# Altium schematic sheet Top_schematic.SchDoc
size A4; SheetNumber: 1; SheetTotal: 18
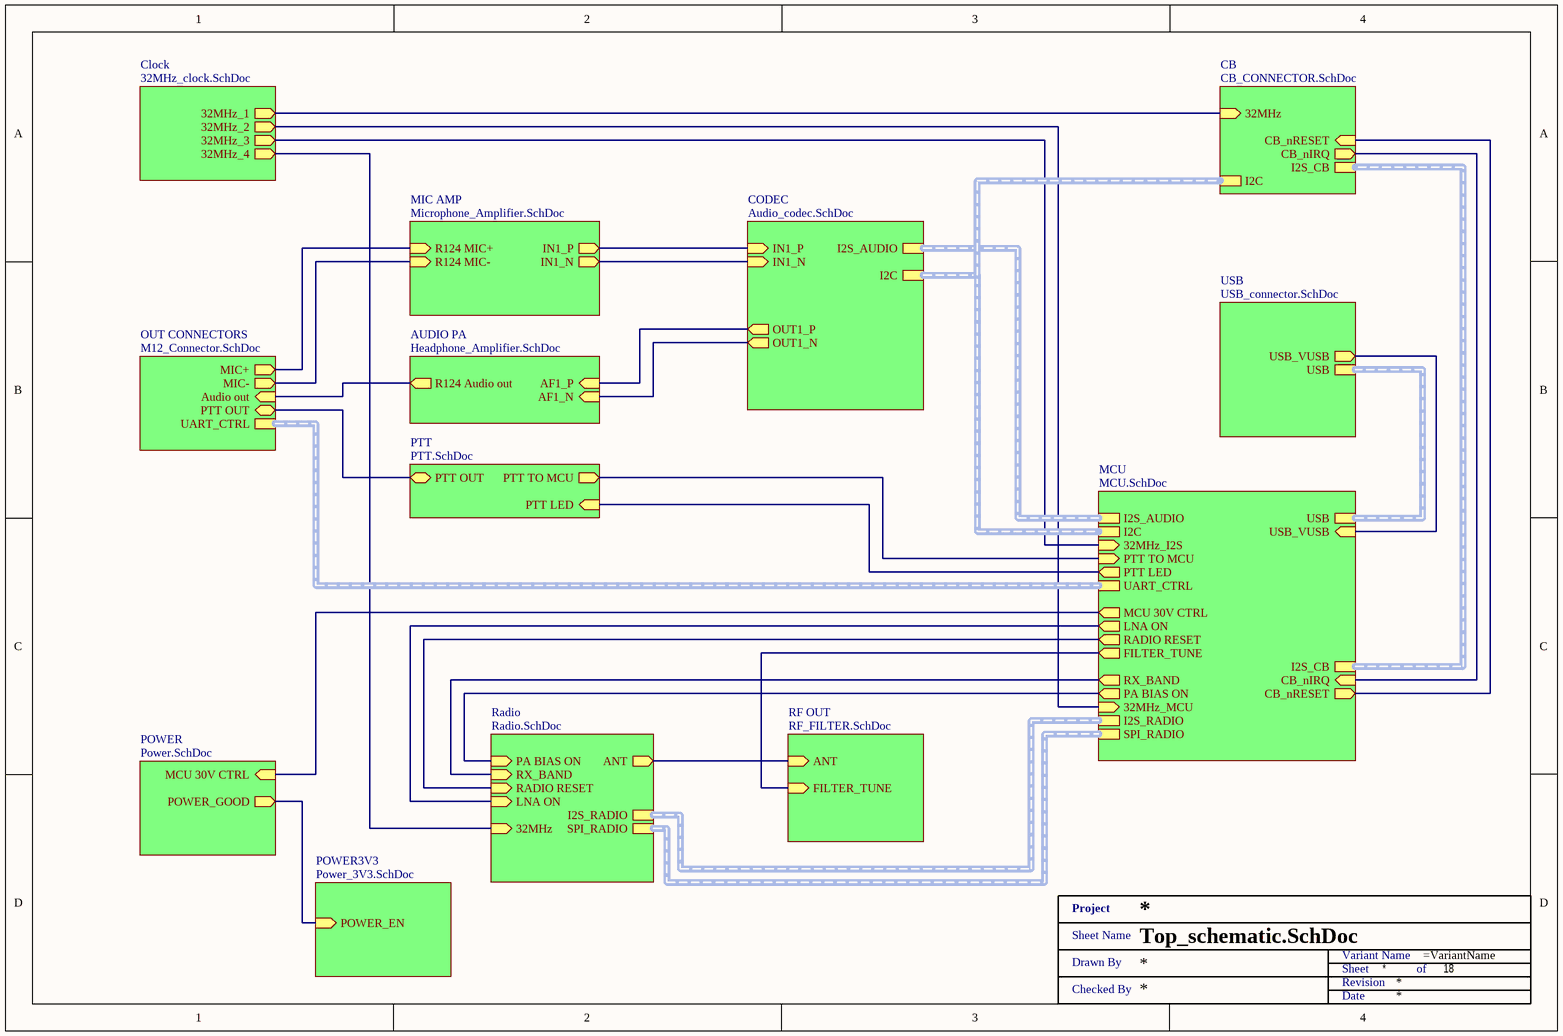
[diagram p0: Top_schematic.SchDoc]

## Parts
XX?  Title 1  (value not drawn)  (graphical)

## Sub-sheets
AUDIO PA = Headphone_Amplifier.SchDoc: R124 Audio out (out), AF1_P (in), AF1_N (in)
CB = CB_CONNECTOR.SchDoc: I2S_CB, CB_nIRQ (out), CB_nRESET (in), I2C, 32MHz (in)
Clock = 32MHz_clock.SchDoc: 32MHz_1 (out), 32MHz_2 (out), 32MHz_4 (out), 32MHz_3 (out)
CODEC = Audio_codec.SchDoc: I2S_AUDIO (harness I2S), IN1_P (in), IN1_N (in), OUT1_N (out), OUT1_P (out), I2C (harness I2C)
MCU = MCU.SchDoc: I2S_AUDIO, PTT TO MCU (in), PTT LED (out), UART_CTRL, SPI_RADIO, I2S_RADIO, 32MHz_MCU (in), PA BIAS ON (out), RX_BAND (out), FILTER_TUNE (out), RADIO RESET (out), USB (harness USB), USB_VUSB (in), MCU 30V CTRL (out), I2C, LNA ON (out), I2S_CB (harness I2S), CB_nIRQ (in), CB_nRESET (out), 32MHz_I2S (in)
MIC AMP = Microphone_Amplifier.SchDoc: R124 MIC+ (in), R124 MIC- (in), IN1_P (out), IN1_N (out)
OUT CONNECTORS = M12_Connector.SchDoc: MIC+ (out), MIC- (out), Audio out (in), PTT OUT (bidir), UART_CTRL (harness UART)
POWER = Power.SchDoc: POWER_GOOD (out), MCU 30V CTRL (in)
POWER3V3 = Power_3V3.SchDoc: POWER_EN (in)
PTT = PTT.SchDoc: PTT LED (in), PTT TO MCU (out), PTT OUT (bidir)
Radio = Radio.SchDoc: PA BIAS ON (in), ANT (out), I2S_RADIO (harness I2S), SPI_RADIO (harness SPI), RX_BAND (in), RADIO RESET (in), LNA ON (in), 32MHz (in)
RF OUT = RF_FILTER.SchDoc: ANT (in), FILTER_TUNE (in)
USB = USB_connector.SchDoc: USB, USB_VUSB (out)

## Nets
(unnamed): sheet POWER/POWER_GOOD, sheet POWER3V3/POWER_EN
(unnamed): sheet POWER/MCU 30V CTRL, sheet MCU/MCU 30V CTRL
(unnamed): sheet OUT CONNECTORS/MIC+, sheet MIC AMP/R124 MIC+
(unnamed): sheet OUT CONNECTORS/MIC-, sheet MIC AMP/R124 MIC-
(unnamed): sheet OUT CONNECTORS/Audio out, sheet AUDIO PA/R124 Audio out
(unnamed): sheet OUT CONNECTORS/PTT OUT, sheet PTT/PTT OUT
(unnamed): sheet MIC AMP/IN1_P, sheet CODEC/IN1_P
(unnamed): sheet MIC AMP/IN1_N, sheet CODEC/IN1_N
(unnamed): sheet AUDIO PA/AF1_P, sheet CODEC/OUT1_P
(unnamed): sheet AUDIO PA/AF1_N, sheet CODEC/OUT1_N
(unnamed): sheet Radio/PA BIAS ON, sheet MCU/PA BIAS ON
(unnamed): sheet Radio/ANT, sheet RF OUT/ANT
(unnamed): sheet Radio/RX_BAND, sheet MCU/RX_BAND
(unnamed): sheet Radio/RADIO RESET, sheet MCU/RADIO RESET
(unnamed): sheet Radio/LNA ON, sheet MCU/LNA ON
(unnamed): sheet Radio/32MHz, sheet Clock/32MHz_4
(unnamed): sheet RF OUT/FILTER_TUNE, sheet MCU/FILTER_TUNE
(unnamed): sheet MCU/PTT TO MCU, sheet PTT/PTT TO MCU
(unnamed): sheet MCU/PTT LED, sheet PTT/PTT LED
(unnamed): sheet MCU/32MHz_MCU, sheet Clock/32MHz_2
(unnamed): sheet MCU/USB_VUSB, sheet USB/USB_VUSB
(unnamed): sheet MCU/CB_nIRQ, sheet CB/CB_nIRQ
(unnamed): sheet MCU/CB_nRESET, sheet CB/CB_nRESET
(unnamed): sheet MCU/32MHz_I2S, sheet Clock/32MHz_3
(unnamed): sheet CB/32MHz, sheet Clock/32MHz_1

## Buses and harness runs
harness sheet CB/I2C = sheet CODEC/I2C = sheet MCU/I2C
harness sheet CB/I2S_CB = sheet MCU/I2S_CB
harness sheet CODEC/I2S_AUDIO = sheet MCU/I2S_AUDIO
harness sheet MCU/I2S_RADIO = sheet Radio/I2S_RADIO
harness sheet MCU/SPI_RADIO = sheet Radio/SPI_RADIO
harness sheet MCU/UART_CTRL = sheet OUT CONNECTORS/UART_CTRL
harness sheet MCU/USB = sheet USB/USB

## Notes on the sheet
- (in symbol Title 1) Project; Sheet Name; Variant Name; Drawn By; Sheet; of; Revision; Checked By; Date